# EAGLE design quantum_PSU_V3_0 (EAGLE 9.6.2)
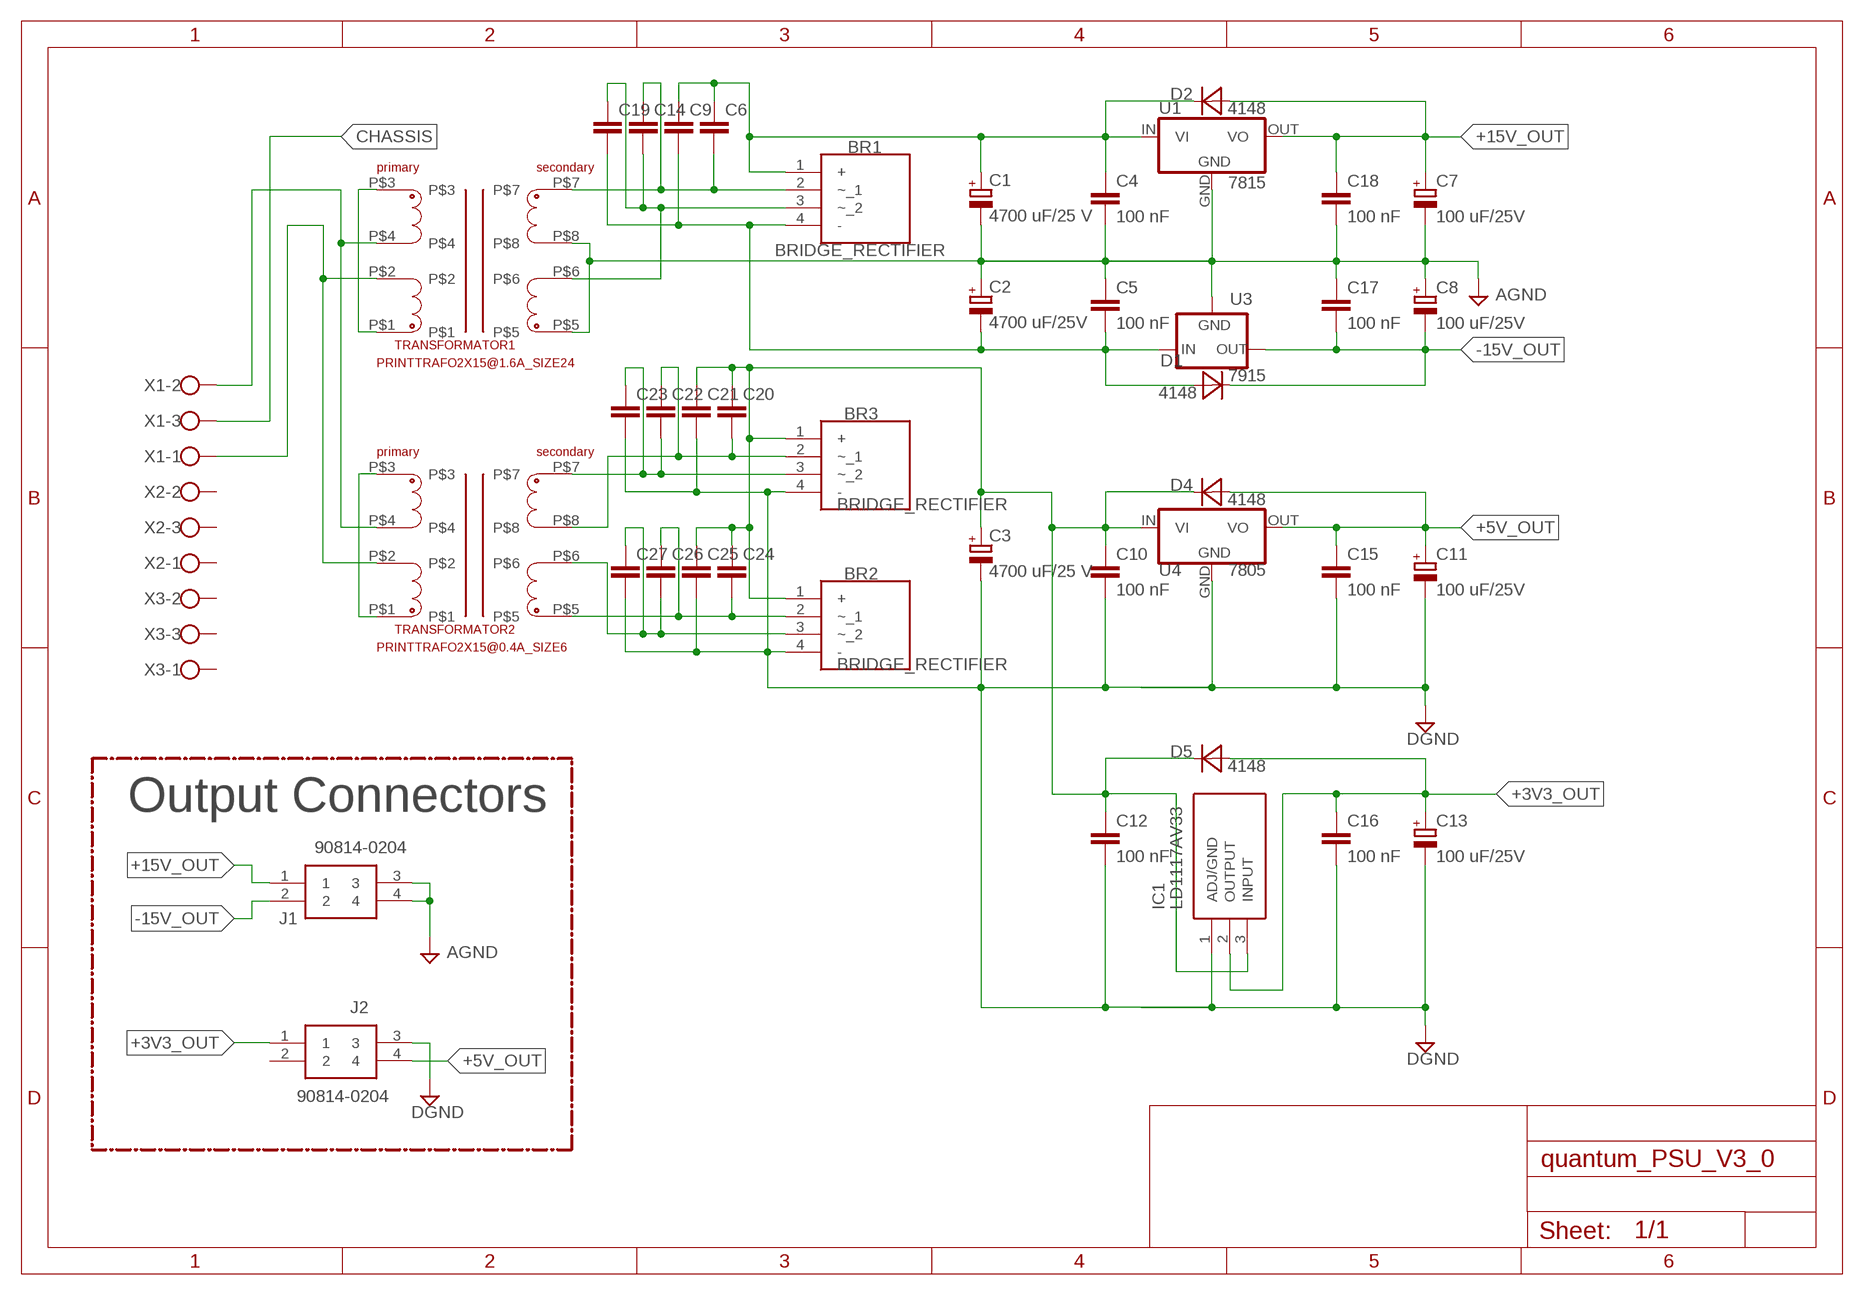
[diagram p0: schematic, sheet 1]

## Parts
BR1  BRIDGE_RECTIFIER  [KBP308G]
BR2  BRIDGE_RECTIFIER  [KBP308G]
BR3  BRIDGE_RECTIFIER  [KBP308G]
C1  4700 uF/25 V  CAPACITOR_ELECTROLYTIC_16MM-THT  [ELECTROLYTIC_16MM]
C2  4700 uF/25V  CAPACITOR_ELECTROLYTIC_16MM-THT  [ELECTROLYTIC_16MM]
C3  4700 uF/25 V  CAPACITOR_ELECTROLYTIC_16MM-THT  [ELECTROLYTIC_16MM]
C4  100 nF  CAPACITOR_5MM  [C5MM]
C5  100 nF  CAPACITOR_5MM  [C5MM]
C6  CAPACITOR_2.5MM  [C2.5MM]
C7  100 uF/25V  CAPACITOR_ELECTROLYTIC_8MM-THT  [ELECTROLYTIC_8MM]
C8  100 uF/25V  CAPACITOR_ELECTROLYTIC_8MM-THT  [ELECTROLYTIC_8MM]
C9  CAPACITOR_2.5MM  [C2.5MM]
C10  100 nF  CAPACITOR_5MM  [C5MM]
C11  100 uF/25V  CAPACITOR_ELECTROLYTIC_8MM-THT  [ELECTROLYTIC_8MM]
C12  100 nF  CAPACITOR_5MM  [C5MM]
C13  100 uF/25V  CAPACITOR_ELECTROLYTIC_8MM-THT  [ELECTROLYTIC_8MM]
C14  CAPACITOR_2.5MM  [C2.5MM]
C15  100 nF  CAPACITOR_5MM  [C5MM]
C16  100 nF  CAPACITOR_5MM  [C5MM]
C17  100 nF  CAPACITOR_5MM  [C5MM]
C18  100 nF  CAPACITOR_5MM  [C5MM]
C19  CAPACITOR_2.5MM  [C2.5MM]
C20  CAPACITOR_2.5MM  [C2.5MM]
C21  CAPACITOR_2.5MM  [C2.5MM]
C22  CAPACITOR_2.5MM  [C2.5MM]
C23  CAPACITOR_2.5MM  [C2.5MM]
C24  CAPACITOR_2.5MM  [C2.5MM]
C25  CAPACITOR_2.5MM  [C2.5MM]
C26  CAPACITOR_2.5MM  [C2.5MM]
C27  CAPACITOR_2.5MM  [C2.5MM]
D1  4148  DIODE_4148_THT  [DIODE_THT_STANDING]
D2  4148  DIODE_4148_THT  [DIODE_THT_STANDING]
D4  4148  DIODE_4148_THT  [DIODE_THT_STANDING]
D5  4148  DIODE_4148_THT  [DIODE_THT_STANDING]
IC1  LD1117AV33  [TO255P460X1020X2008-3P]
J1  90814-0204  [MOLEX_90814-0204]
J2  90814-0204  [MOLEX_90814-0204]
TRANSFORMATOR1  PRINTTRAFO2X15@1.6A_SIZE24  [LP_SIZE_24]
TRANSFORMATOR2  PRINTTRAFO2X15@0.4A_SIZE6  [LP_SIZE_6]
U1  7815  78_THT  [78XXS_]
U3  7915  79_THT  [79XXS]
U4  7805  78_THT  [78XXS_]
X1  CONNECTOR_3POL  [W237-103]
X2  CONNECTOR_3POL  [W237-103]
X3  CONNECTOR_3POL  [W237-103]

## Nets
+3V3_OUT: C13.+ C16.1 D5.A IC1.2(OUTPUT) J2.1
+5V_OUT: C11.+ C15.1 D4.A J2.4 U4.OUT(VO)
+15V_OUT: C7.+ C18.1 D2.A J1.1 U1.OUT(VO)
-15V_OUT: C8.- C17.2 D1.C J1.2 U3.OUT
AGND: C1.- C2.+ C4.2 C5.1 C7.- C8.+ C17.1 C18.2 J1.3 J1.4 TRANSFORMATOR1.P$5 TRANSFORMATOR1.P$8 U1.GND U3.GND
CHASSIS: X1.3
DGND: BR2.4(-) BR3.4(-) C3.- C10.2 C11.- C12.2 C13.- C15.2 C16.2 C21.2 C23.2 C25.2 C27.2 IC1.1(ADJ/GND) J2.3 U4.GND
N$1: BR3.3(~_2) C22.2 C23.1 TRANSFORMATOR2.P$7
N$2: TRANSFORMATOR2.P$1 TRANSFORMATOR2.P$3
N$3: BR1.3(~_2) C14.2 C19.1 TRANSFORMATOR1.P$6
N$4: TRANSFORMATOR1.P$1 TRANSFORMATOR1.P$3
N$6: BR3.2(~_1) C20.2 C22.1 TRANSFORMATOR2.P$8
N$7: BR2.3(~_2) C26.2 C27.1 TRANSFORMATOR2.P$6
N$8: TRANSFORMATOR1.P$4 TRANSFORMATOR2.P$4 X1.2
N$9: TRANSFORMATOR1.P$2 TRANSFORMATOR2.P$2 X1.1
N$10: BR2.1(+) BR3.1(+) C3.+ C10.1 C12.1 C20.1 C21.1 C24.1 C25.1 D4.C D5.C IC1.3(INPUT) U4.IN(VI)
N$11: BR1.2(~_1) C6.2 C14.1 TRANSFORMATOR1.P$7
N$12: BR2.2(~_1) C24.2 C26.1 TRANSFORMATOR2.P$5
N$15: BR1.1(+) C1.+ C4.1 C6.1 C9.1 D2.C U1.IN(VI)
N$17: BR1.4(-) C2.- C5.2 C9.2 C19.2 D1.A U3.IN
Unconnected: J2.2 X2.1 X2.2 X2.3 X3.1 X3.2 X3.3

## Notes on the sheet
- Output Connectors

## Library data of the parts
BR1-BR3 = passive components:BRIDGE_RECTIFIER: Bridge Rectifiers Bridge Rectifier KBP Source: Datasheet <https://componentsearchengine.com/Datasheets/1/KBP308G.pdf>; DESCRIPTION: Bridge Rectifiers Bridge Rectifier KBP; HEIGHT: 3mm; MANUFACTURER_NAME: Diodes Inc.; MANUFACTURER_PART_NUMBER: KBP308G; MOUSER_PART_NUMBER: 621-KBP308G; MOUSER_PRICE-STOCK: https://www.mouser.com/Search/Refine.aspx?Keyword=621-KBP308G
C1-C3 C7 C8 C11 C13 = passive components:CAPACITOR_ELECTROLYTIC: Electrolytic Capacitor SMD
C4-C6 C9 C10 C12 C14-C27 = passive components:CAPACITOR: ceramic capacitor
D1 D2 D4 D5 = passive components:DIODE: Standard 4148 Diode SOD323 Format; MOUSER_PART_NUMBER: ...
IC1 = passive components:LD1117AV33: LD1117AV33, Low Dropout Voltage Regulator, 1.2A, 3.3 V +/-2%, 3-Pin TO-220 Source: Datasheet <http://www.st.com/web/en/resource/technical/document/datasheet/CD00002116.pdf>; DESCRIPTION: LD1117AV33, Low Dropout Voltage Regulator, 1.2A, 3.3 V +/-2%, 3-Pin TO-220; HEIGHT: 4.6mm; MANUFACTURER_NAME: STMicroelectronics; MANUFACTURER_PART_NUMBER: LD1117AV33; MOUSER_PART_NUMBER: 511-LD1117AV33; MOUSER_PRICE-STOCK: https://www.mouser.co.uk/ProductDetail/STMicroelectronics/LD1117AV33?qs=hUhhBvpTJN9Rfx8G8TXH1A%3D%3D
J1 J2 = electro_mechanical:90814-0204: CONN HEADER 4POS 1.27MM SMD TIN Source: Datasheet <https://componentsearchengine.com/Datasheets/1/90814-0204.pdf>; DESCRIPTION: CONN HEADER 4POS 1.27MM SMD TIN; HEIGHT: mm; MANUFACTURER_NAME: Molex; MANUFACTURER_PART_NUMBER: 90814-0204; MOUSER_PART_NUMBER: 538-90814-0204; MOUSER_PRICE-STOCK: https://www.mouser.com/Search/Refine.aspx?Keyword=538-90814-0204
TRANSFORMATOR1 = passive components:PRINTTRAFO: Printtrafo several siyes availlable; MOUSER_PART_NUMBER: 530-LP-30-800
TRANSFORMATOR2 = passive components:PRINTTRAFO: Printtrafo several siyes availlable; MOUSER_PART_NUMBER: 530-LP-30-200
U1 U4 = passive components:78**
U3 = passive components:79**: VOLTAGE REGULATOR
X1-X3 = electro_mechanical:CONNECTOR: WAGO SCREW CLAMP

## Board
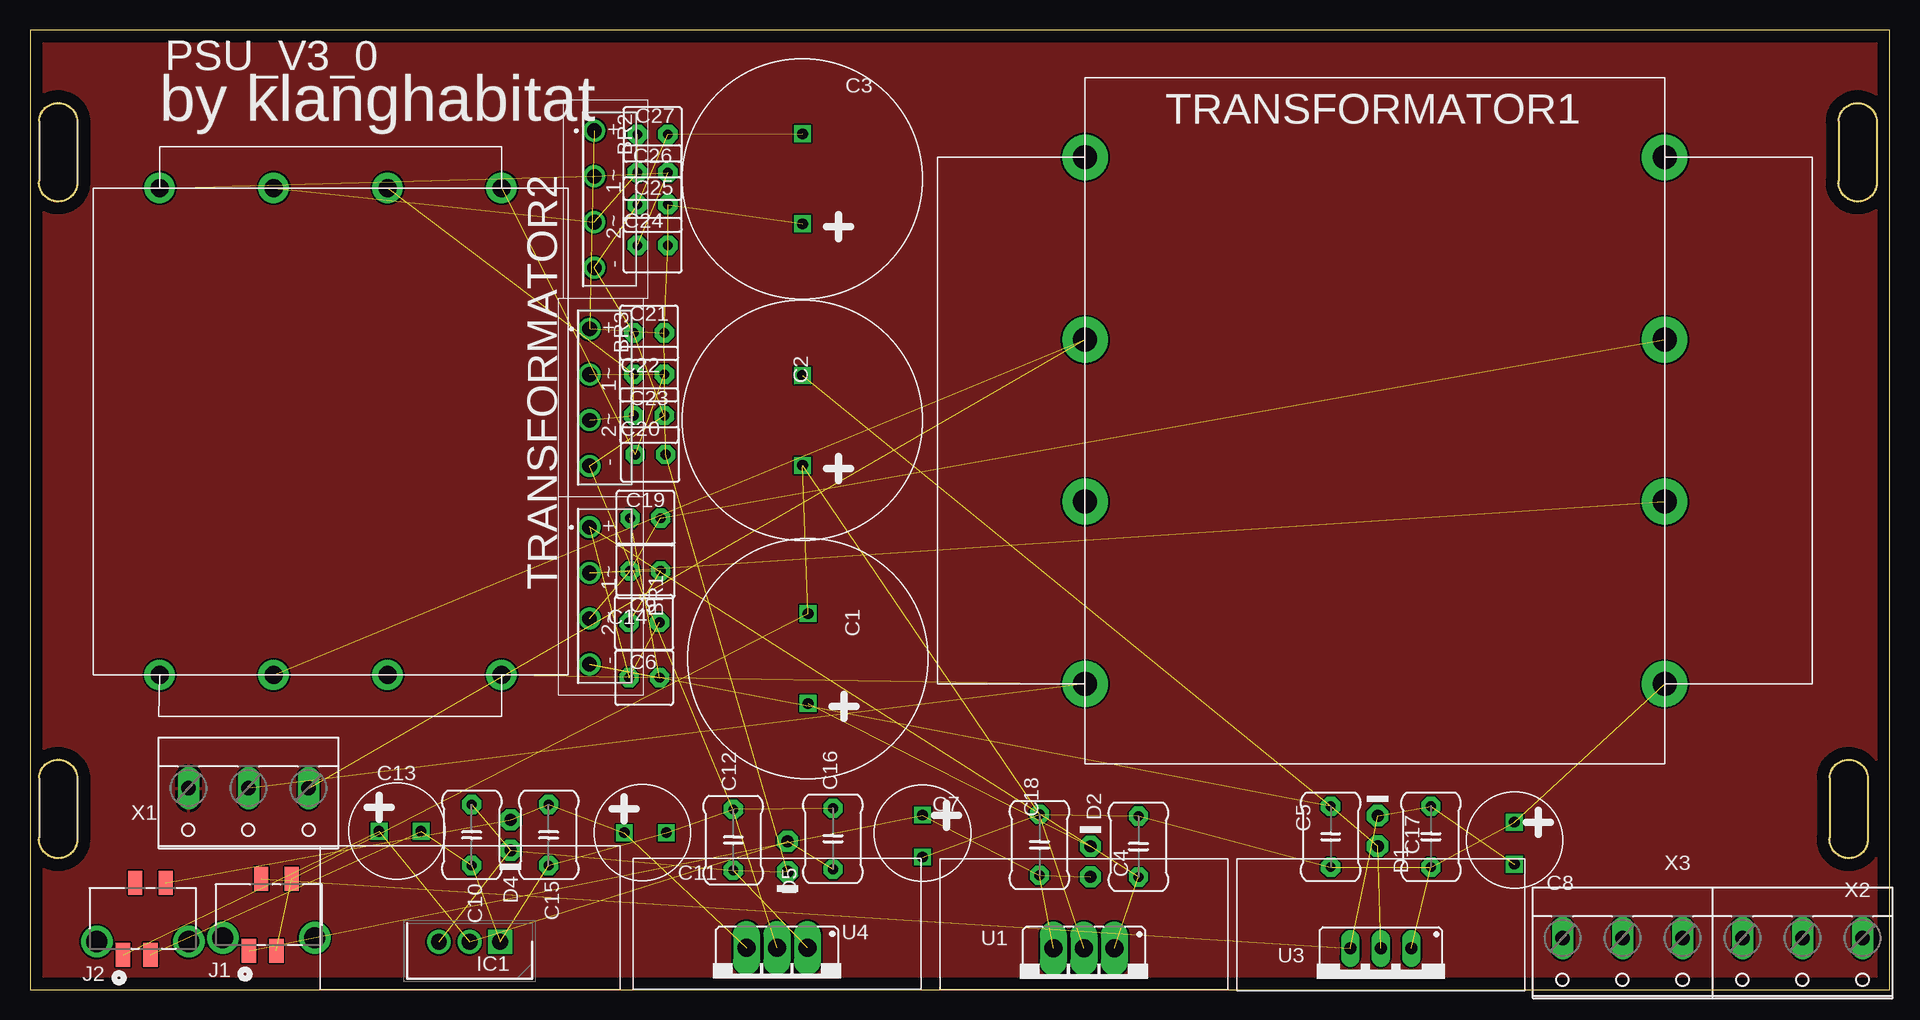
[diagram p1: board, top side]
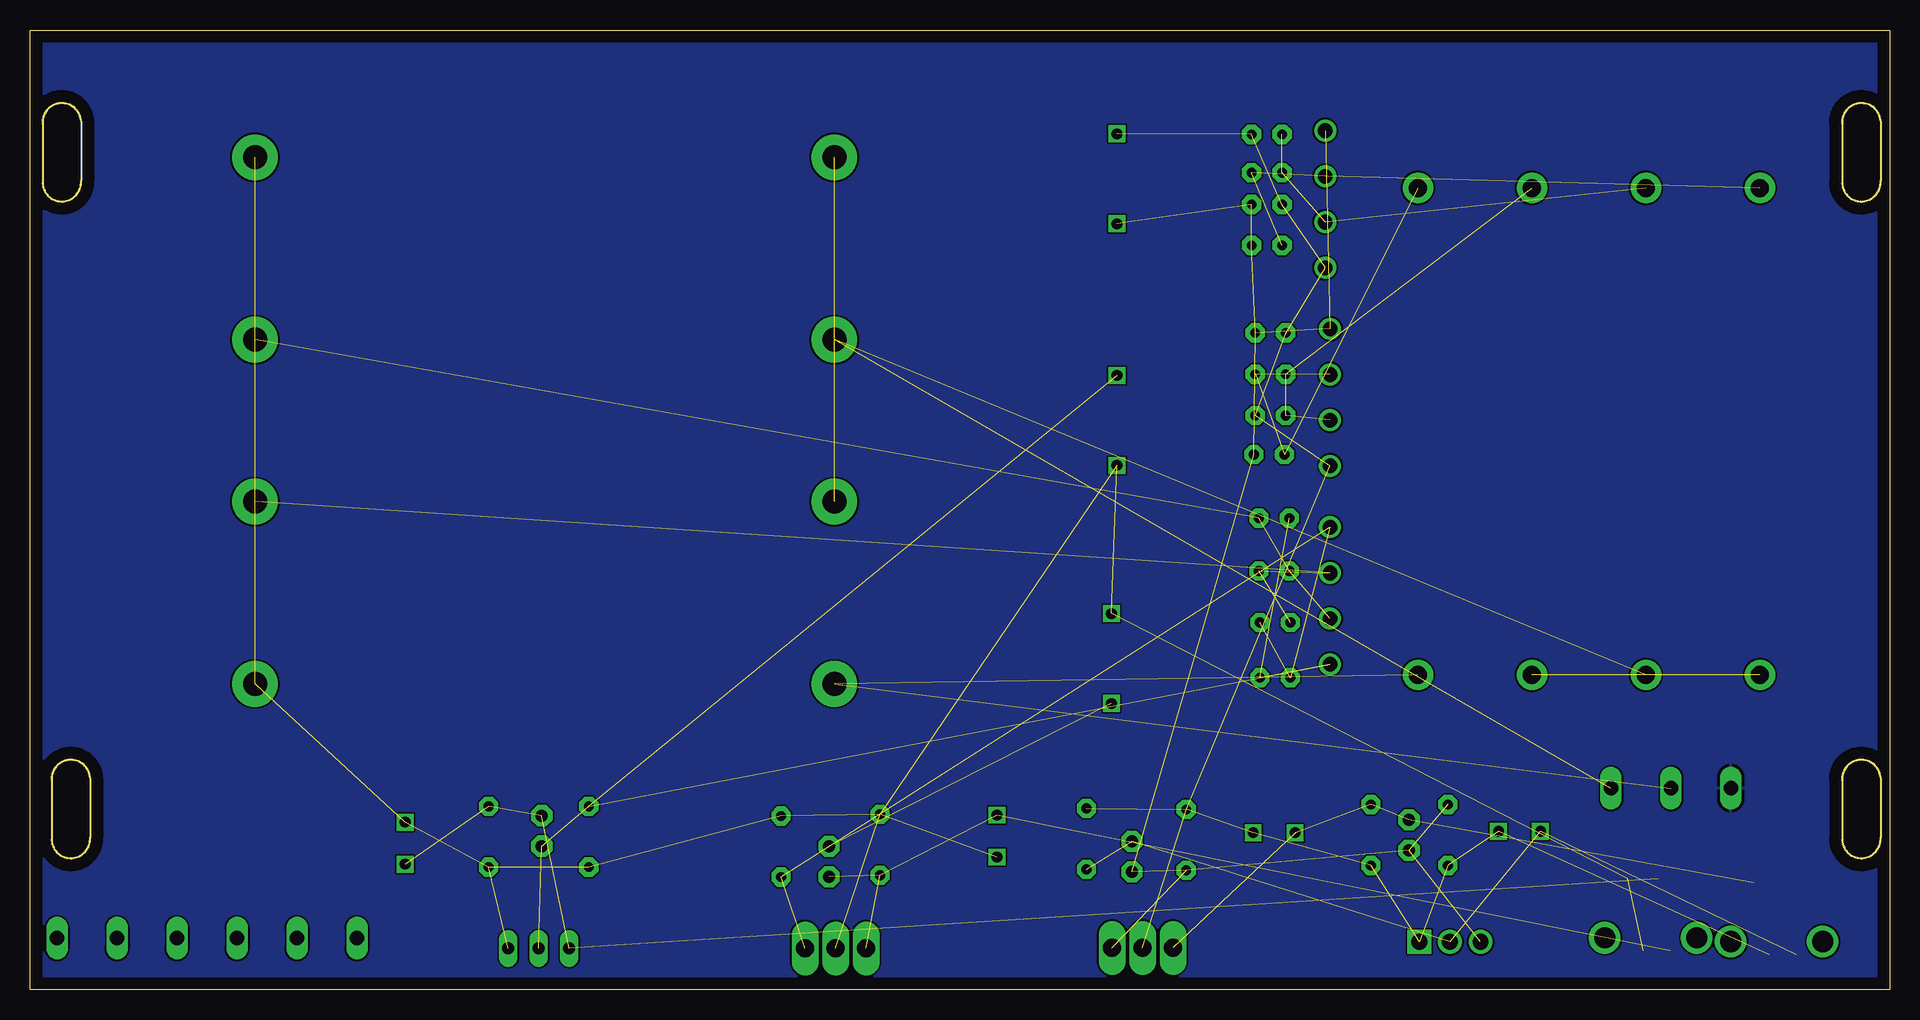
[diagram p2: board, bottom side, seen from below]

Size 155 x 80 mm. Coordinates in mm from the lower left corner, seen from the top.
Outline: 0,0 155,0 155,80 0,80 0,0
Outline: 150,17.65 arc-180 153.2,17.45 153.2,12.45 arc-180 150,12.65 150,17.65
Outline: 150.75,72.4 arc-180 153.95,72.2 153.95,67.2 arc-180 150.75,67.4 150.75,72.4
Outline: 0.75,17.65 arc-180 3.95,17.45 3.95,12.45 arc-180 0.75,12.65 0.75,17.65
Outline: 0.75,72.4 arc-180 3.95,72.2 3.95,67.2 arc-180 0.75,67.4 0.75,72.4
Copper layers (1*16): Top 0.035mm / dielectric 1.5mm / Bottom 0.035mm
Design rules "default *": minimum track width 6mil, minimum drill 0.35mm, track to track 6mil, track to pad 6mil, pad to pad 6mil, via to via 6mil, smd to smd 6mil, copper to edge 40mil, drill to drill 6mil, minimum pad ring 10mil, minimum via ring 8mil, stop-mask expansion 4mil, vias tented up to drill 0mil, thermal gap 10mil

### Footprints (pad centres in the part's own frame; a part is rotated, then mirrored left to right if it is on the bottom)
KBP308G = drill 1.22 pad 1.83: 1 -5.715,-0.95; 2 -1.905,-0.95; 3 1.905,-0.95; 4 5.715,-0.95
ELECTROLYTIC_16MM = drill 0.9 square: + -3.75,0; - 3.75,0
C5MM = drill 0.813 pad 1.6 octagon: 1 -1.27,0; 2 3.81,0
C2.5MM = drill 0.813 pad 1.6 octagon: 1 -1.27,0; 2 1.27,0
ELECTROLYTIC_8MM = drill 0.9 square: + -1.5,0; - 2,0
DIODE_THT_STANDING = drill 1 pad 1.778 octagon: A 0,0; C -2.54,0
TO255P460X1020X2008-3P = drill 1.32 pad 1.98 square: 1 0,0 | drill 1.32 pad 1.98: 2 2.55,0; 3 5.1,0
MOLEX_90814-0204 = smd 1.194 x 2.007: 1 0.254,0; 2 1.27,5.994; 3 2.54,0; 4 3.81,5.994 | drill 1.753 pad 2.629: 5 -1.93,1.092; 6 5.74,1.092
LP_SIZE_24 = drill 2 pad 3.81: P$1 12.3,50.55; P$2 12.3,35.35; P$3 12.3,21.85; P$4 12.3,6.65; P$5 60.6,50.55; P$6 60.6,35.35; P$7 60.6,21.85; P$8 60.6,6.65
LP_SIZE_6 = drill 1.5 pad 2.54: P$1 3.45,34.05; P$2 3.45,24.55; P$3 3.45,15.05; P$4 3.45,5.55; P$5 44.05,34.05; P$6 44.05,24.55; P$7 44.05,15.05; P$8 44.05,5.55
78XXS_ = drill 1.499 pad 1.93 long: GND 0,-2.54; IN -2.54,-2.54; OUT 2.54,-2.54
79XXS = drill 1.016 long: GND -2.54,-2.54; IN 0,-2.54; OUT 2.54,-2.54
W237-103 = drill 1.194 long: 1 -5,-1.29; 2 0,-1.29; 3 5,-1.29

### Placement (x,y rotation side)
BR1  47.58,32.83 270 top
BR2  47.99,65.89 270 top
BR3  47.59,49.37 270 top
C1  64.85,27.59 90 top
C2  64.39,47.45 90 top
C3  64.39,67.59 90 top
C4  92.4,10.65 90 top
C5  108.42,11.47 90 top
C6  51.2,30.6 180 top
C7  74.4,13.04 270 top
C8  123.73,12.45 270 top
C9  51.2,26 0 top
C10  36.82,14.15 270 top
C11  51.04,13.07 0 top
C12  58.62,11.2 90 top
C13  30.59,13.19 0 top
C14  51.3,34.9 180 top
C15  43.23,14.15 270 top
C16  66.93,11.3 90 top
C17  116.78,11.47 90 top
C18  84.15,10.79 90 top
C19  51.3,39.3 180 top
C20  51.7,44.6 180 top
C21  51.6,54.75 180 top
C22  51.6,51.3 180 top
C23  51.6,47.85 0 top
C24  51.9,62.05 180 top
C25  51.9,65.45 180 top
C26  51.9,68.1 180 top
C27  51.9,71.3 0 top
D1  112.34,11.95 270 top
D2  88.4,9.4 270 top
D4  40.05,14.15 90 top
D5  63.15,12.35 90 top
IC1  39.19,3.97 180 top
J1  18,3.22 0 top
J2  7.5,2.91 0 top
TRANSFORMATOR1  75.65,18.83 0 top
TRANSFORMATOR2  44.86,22.78 90 top
U1  87.84,0.9 180 top
U3  112.6,0.89 180 top
U4  62.26,0.93 180 top
X1  18.21,15.5 180 top
X2  147.75,3 180 top
X3  132.75,3 180 top

### Tracks (layer width: path | path; a pad name or v marks a point on that pad's centre or on a via)
+3V3_OUT  (4 unrouted)
+5V_OUT  (4 unrouted)
+15V_OUT  (4 unrouted)
-15V_OUT  (4 unrouted)
AGND  (13 unrouted)
CHASSIS
  pour Bottom: -3.29,84.65 -3.29,-4.04 155.02,-4.04 155.02,84.65
  pour Top: -2.3,85.25 -2.3,-3.7 155.9,-3.7 155.9,85.25
DGND  (15 unrouted)
N$1  (3 unrouted)
N$2  (1 unrouted)
N$3  (3 unrouted)
N$4  (1 unrouted)
N$6  (3 unrouted)
N$7  (3 unrouted)
N$8  (2 unrouted)
N$9  (2 unrouted)
N$10  (12 unrouted)
N$11  (3 unrouted)
N$12  (3 unrouted)
N$15  (6 unrouted)
N$17  (6 unrouted)

### Text on the board
tNames: PSU_V3_0 | by klanghabitat